# Altium project solar_power.PrjPCB
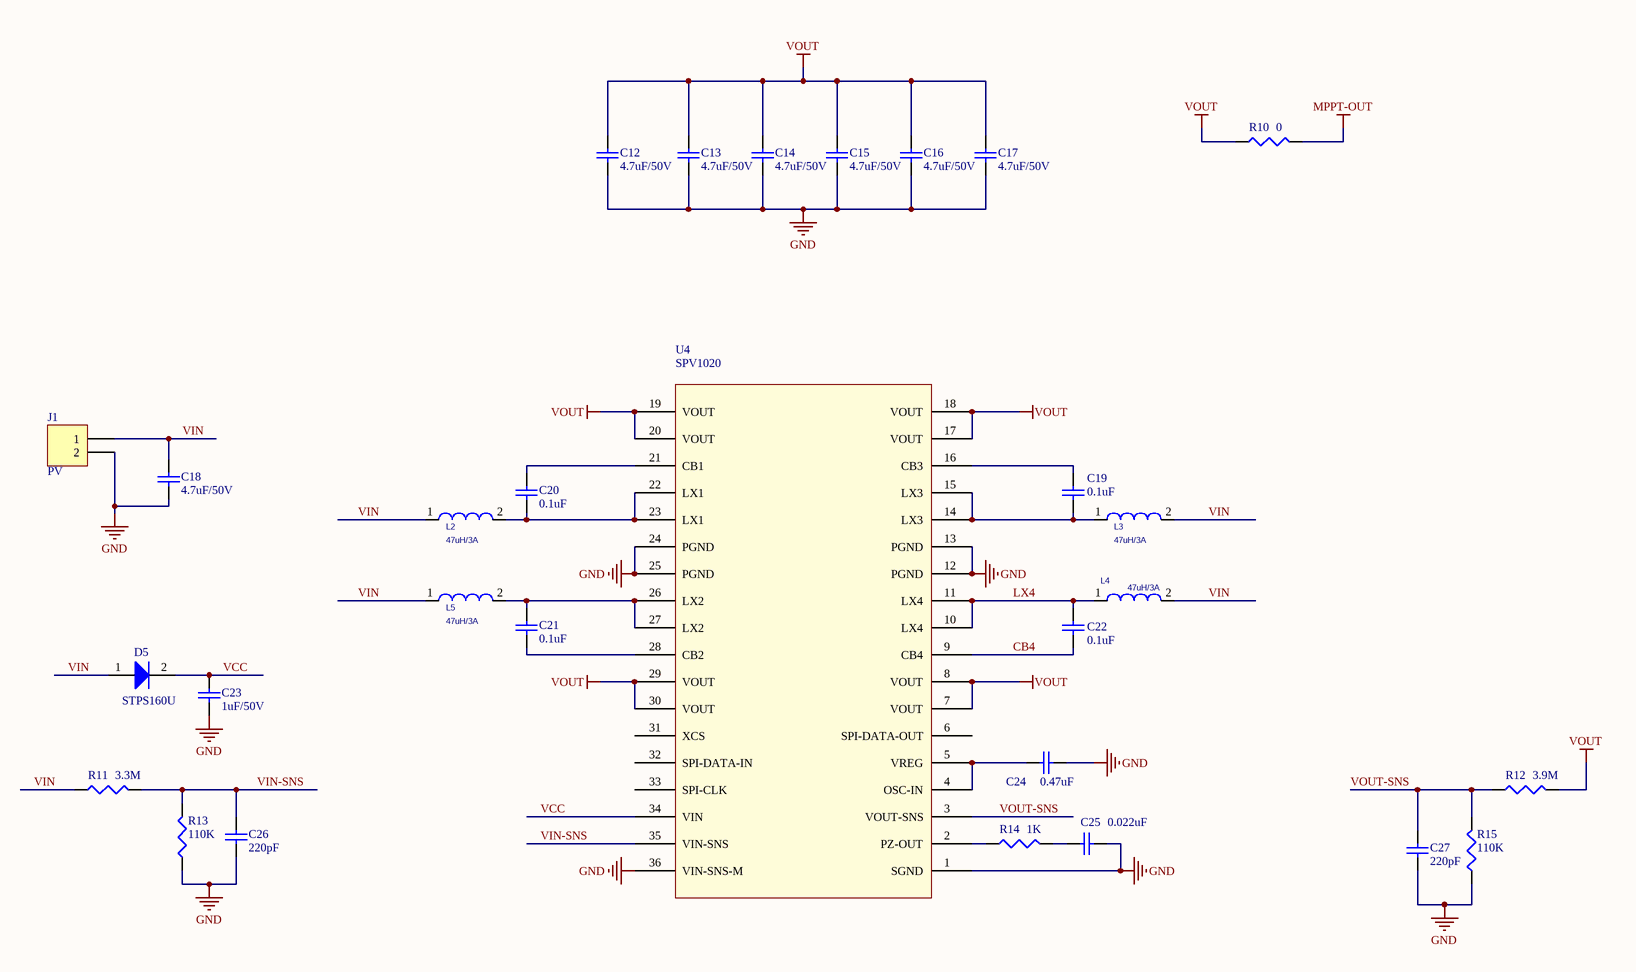
[diagram p0: mppt.SchDoc]
3 sheets, 84 parts. Net scope: global (net labels, ports and power ports of the same name join across sheets).
Board file: solar_power.PcbDoc
Sheets:
  mppt.SchDoc
  cc_cv_charger.SchDoc
  overdischarge_protection.SchDoc

## Sheet mppt.SchDoc
size B

### Parts
C12  4.7uF/50V  [1812]
C13  4.7uF/50V  [1812]
C14  4.7uF/50V  [1812]
C15  4.7uF/50V  [1812]
C16  4.7uF/50V  [1812]
C17  4.7uF/50V  [1812]
C18  4.7uF/50V  [1812]
C19  0.1uF  [0603]
C20  0.1uF  [0603]
C21  0.1uF  [0603]
C22  0.1uF  [0603]
C23  1uF/50V  [1210]
C24  0.47uF  [0603]
C25  0.022uF  [0603]
C26  220pF  [0603]
C27  220pF  [0603]
D5  STPS160U  [B320A]
J1  PV  [T-2PIN]
L2  47uH/3A  [IND-47UH-3A]
L3  47uH/3A  [IND-47UH-3A]
L4  47uH/3A  [IND-47UH-3A]
L5  47uH/3A  [IND-47UH-3A]
R10  0  [BREAK]
R11  3.3M  [0603]
R12  3.9M  [0603]
R13  110K  [0603]
R14  1K  [0603]
R15  110K  [0603]
U4  SPV1020  [POWERSSOP36]

### Nets
GND: C12.1 C13.1 C14.1 C15.1 C16.1 C17.1 C18.1 C23.1 C24.2 C25.2 C26.1 C27.1 J1.2 R13.1 R15.1 U4.1(SGND) U4.12(PGND) U4.13(PGND) U4.24(PGND) U4.25(PGND) U4.36(VIN-SNS-M)
MPPT-OUT: R10.2
VOUT: C12.2 C13.2 C14.2 C15.2 C16.2 C17.2 R10.1 R12.2 U4.7(VOUT) U4.8(VOUT) U4.17(VOUT) U4.18(VOUT) U4.19(VOUT) U4.20(VOUT) U4.29(VOUT) U4.30(VOUT)
CB4: C22.1 U4.9(CB4)
LX4: C22.2 L4.1 U4.10(LX4) U4.11(LX4)
VCC: C23.2 D5.2(K) U4.34(VIN)
VIN: C18.2 D5.1(A) J1.1 L2.1 L3.2 L4.2 L5.1 R11.1
VIN-SNS: C26.2 R11.2 R13.2 U4.35(VIN-SNS)
VOUT-SNS: C27.2 R12.1 R15.2 U4.3(VOUT-SNS)
NetC19_1: C19.1 L3.1 U4.14(LX3) U4.15(LX3)
NetC19_2: C19.2 U4.16(CB3)
NetC20_1: C20.1 L2.2 U4.22(LX1) U4.23(LX1)
NetC20_2: C20.2 U4.21(CB1)
NetC21_1: C21.1 U4.28(CB2)
NetC21_2: C21.2 L5.2 U4.26(LX2) U4.27(LX2)
NetC24_1: C24.1 U4.4(OSC-IN) U4.5(VREG)
NetC25_1: C25.1 R14.2
NetR14_1: R14.1 U4.2(PZ-OUT)

Not connected (* = marked no-connect by the designer): U4 6(SPI-DATA-OUT) 31(XCS) 32(SPI-DATA-IN) 33(SPI-CLK)

### Library data of the parts
C12-C27 = Cap: Capacitor; Value: 100pF; Published: 8-Jun-2000; LatestRevisionDate: 17-Jul-2002; LatestRevisionNote: Re-released for DXP Platform.; PackageReference: RAD-0.3; Publisher: Altium Limited; PackageDescription: Radial Cap, Thru-Hole; 2 Leads; 0.3 in Pin Spacing
D5 = Diode: Default Diode; Published: 8-Jun-2000; LatestRevisionDate: 17-Jul-2002; LatestRevisionNote: Re-released for DXP Platform.; PackageVersion: Sep-1996; PackageReference: SMC; Publisher: Altium Limited; PackageDescription: DO-214-AB/SMC; 2 C-Bend Leads; Body 7.9 x 5.9 mm, inc. leads (LxW); Code_JEDEC: DO-214-AB
J1 = Header 2: Header, 2-Pin; LatestRevisionDate: 17-Jul-2002; LatestRevisionNote: Re-released for DXP Platform.; Publisher: Altium Limited
L2-L5 = 4.7UH_CDH2D09BNP-4R7MC_0.7A_20%: Part Number: SH00000AJ00; ROOM: +1.3V_CORE
R10-R13 R15 = Res3: Resistor; Value: 1K; Published: 8-Jun-2000; LatestRevisionDate: 29-May-2009; LatestRevisionNote: IPC-7351 Footprint Added.; PackageReference: J1-0603; Publisher: Altium Limited; PackageDescription: Chip Resistor
R14 = Res3: Resistor; Published: 8-Jun-2000; LatestRevisionDate: 29-May-2009; LatestRevisionNote: IPC-7351 Footprint Added.; PackageReference: J1-0603; Publisher: Altium Limited; PackageDescription: Chip Resistor; Value: 1K

## Sheet cc_cv_charger.SchDoc
size B
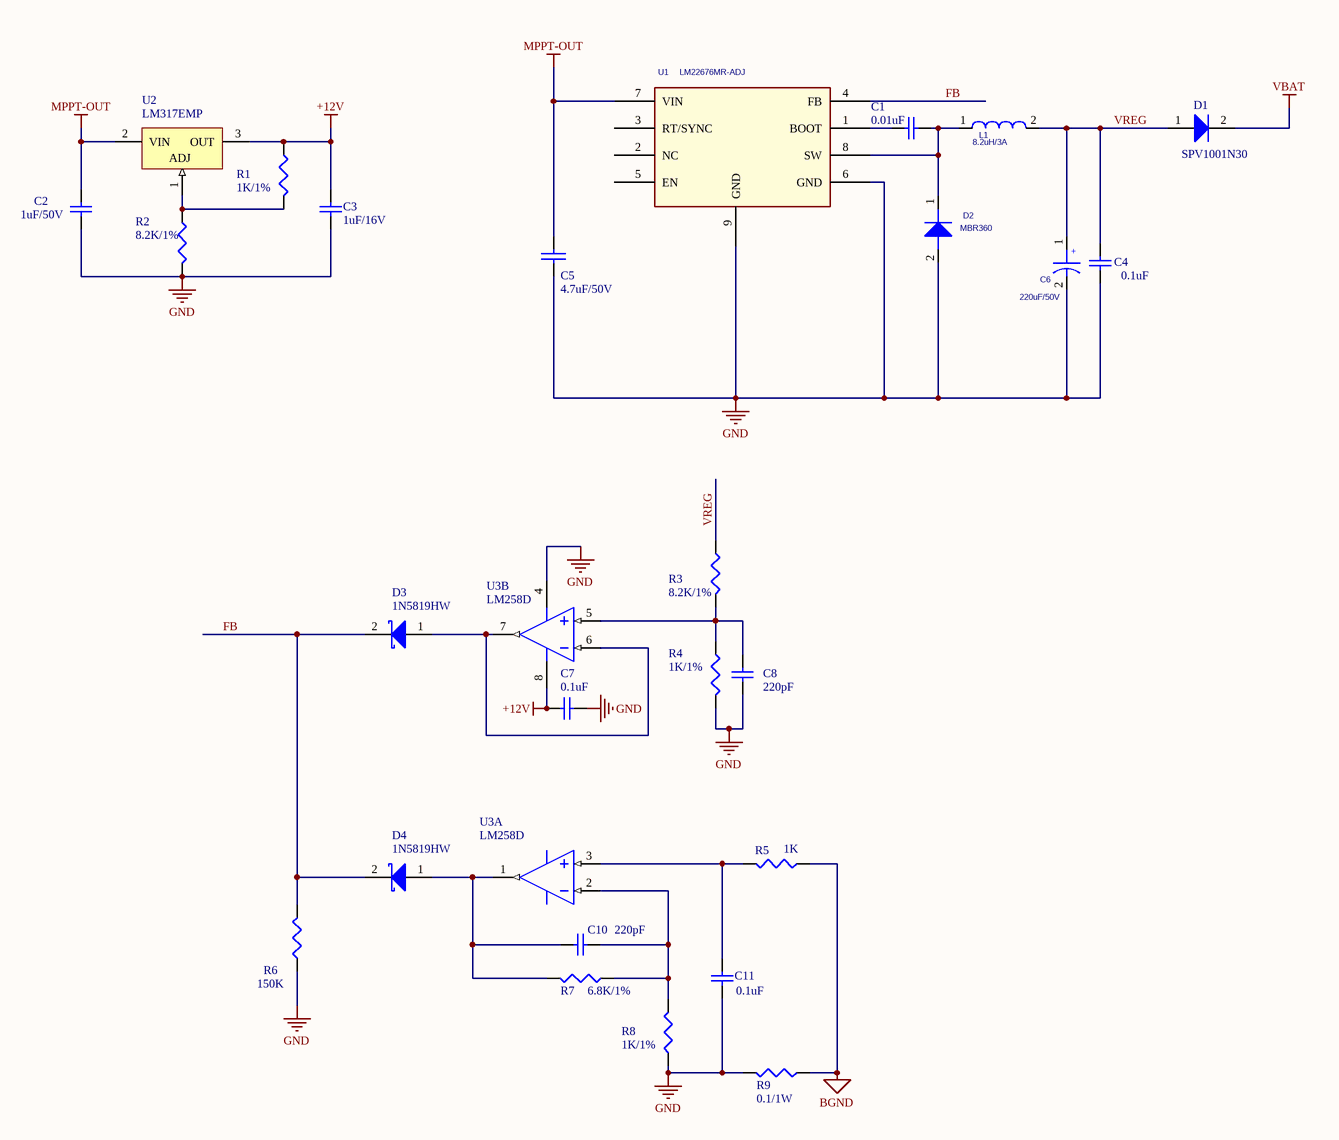
[diagram p1: cc_cv_charger.SchDoc]

### Parts
C1  0.01uF  [0603]
C2  1uF/50V  [1210]
C3  1uF/16V  [0805]
C4  0.1uF  [0603]
C5  4.7uF/50V  [1812]
C6  220uF/50V  [DL-10*10.5]
C7  0.1uF  [0603]
C8  220pF  [0603]
C10  220pF  [0603]
C11  0.1uF  [0603]
D1  SPV1001N30  [SPV1001]
D2  MBR360  [DO214AB]
D3  1N5819HW  [1N5819]
D4  1N5819HW  [1N5819]
L1  8.2uH/3A  [IND_8.2UH_3A]
R1  1K/1%  [0603]
R2  8.2K/1%  [0603]
R3  8.2K/1%  [0603]
R4  1K/1%  [0603]
R5  1K  [0603]
R6  150K  [0603]
R7  6.8K/1%  [0603]
R8  1K/1%  [0603]
R9  0.1/1W  [2512]
U1  LM22676MR-ADJ  [PSO8]
U2  LM317EMP  [LM317]
U3  LM258D  [SO8]  (parts A,B of 2)

### Nets
+12V: C3.2 C7.2 R1.1 U2.3(OUT) U3.8(V+)
BGND: R5.1 R9.1
GND: C2.1 C3.1 C4.1 C5.2 C6.2 C7.1 C8.2 C11.2 D2.2 R2.2 R4.2 R6.1 R8.1 R9.2 U1.6(GND) U1.9(GND) U3.4(GND)
MPPT-OUT: C2.2 C5.1 U1.7(VIN) U2.2(VIN)
VBAT: D1.2(K)
FB: D3.2(K) D4.2(K) R6.2 U1.4(FB)
VREG: C4.2 C6.1 D1.1(A) L1.2 R3.1
NetC1_1: C1.1 D2.1 L1.1 U1.8(SW)
NetC1_2: C1.2 U1.1(BOOT)
NetC8_1: C8.1 R3.2 R4.1 U3.5(INB+)
NetC10_1: C10.1 R7.1 R8.2 U3.2(INA-)
NetC10_2: C10.2 D4.1(A) R7.2 U3.1(OUTA)
NetC11_1: C11.1 R5.2 U3.3(INA+)
NetD3_1: D3.1(A) U3.6(INB-) U3.7(OUTB)
NetR1_2: R1.2 R2.1 U2.1(ADJ)

Not connected (* = marked no-connect by the designer): U1 2(NC) 3(RT/SYNC) 5(EN)

### Notes on the sheet
- (in symbol CAP WP) +

### Library data of the parts
C1-C3 = Cap: Capacitor; Value: 0.1uF; Published: 8-Jun-2000; LatestRevisionDate: 17-Jul-2002; LatestRevisionNote: Re-released for DXP Platform.; PackageReference: RAD-0.3; Publisher: Altium Limited; PackageDescription: Radial Cap, Thru-Hole; 2 Leads; 0.3 in Pin Spacing
C4 C7 C11 = Cap: Capacitor; Published: 8-Jun-2000; LatestRevisionDate: 17-Jul-2002; LatestRevisionNote: Re-released for DXP Platform.; PackageReference: RAD-0.3; Publisher: Altium Limited; PackageDescription: Radial Cap, Thru-Hole; 2 Leads; 0.3 in Pin Spacing; Value: 0.1uF
C5 = CAP: Capacitor
C6 = CAP WP
C8 C10 = Cap: Capacitor; Value: 1000pF; Published: 8-Jun-2000; LatestRevisionDate: 17-Jul-2002; LatestRevisionNote: Re-released for DXP Platform.; PackageReference: RAD-0.3; Publisher: Altium Limited; PackageDescription: Radial Cap, Thru-Hole; 2 Leads; 0.3 in Pin Spacing
D1 = Diode: Default Diode; Published: 8-Jun-2000; LatestRevisionDate: 17-Jul-2002; LatestRevisionNote: Re-released for DXP Platform.; PackageVersion: Sep-1996; PackageReference: SMC; Publisher: Altium Limited; PackageDescription: DO-214-AB/SMC; 2 C-Bend Leads; Body 7.9 x 5.9 mm, inc. leads (LxW); Code_JEDEC: DO-214-AB
D2 = 1N4148WS-7-F_SOD323-2
D3 D4 = Diode 11DQ03: Schottky Rectifier
L1 = 4.7UH_CDH2D09BNP-4R7MC_0.7A_20%: as L2 on sheet mppt
R1-R4 R8 = Res3: Resistor; Value: 1K; Published: 8-Jun-2000; LatestRevisionDate: 29-May-2009; LatestRevisionNote: IPC-7351 Footprint Added.; PackageReference: J1-0603; Publisher: Altium Limited; PackageDescription: Chip Resistor
R5 R6 R9 = Res3: Resistor; Published: 8-Jun-2000; LatestRevisionDate: 29-May-2009; LatestRevisionNote: IPC-7351 Footprint Added.; PackageReference: J1-0603; Publisher: Altium Limited; PackageDescription: Chip Resistor
  R5: Value: 1K
  R6: Value: 150K
  R9: Value: 0.1/1W
R7 = Res3: Resistor; Value: 5.1K; Published: 8-Jun-2000; LatestRevisionDate: 29-May-2009; LatestRevisionNote: IPC-7351 Footprint Added.; PackageReference: J1-0603; Publisher: Altium Limited; PackageDescription: Chip Resistor
U1 = LM22670_0
U2 = LM317K STEEL: 3-Terminal Adjustable Regulator, 3-pin TO-3; Manufacturer: National Semiconductor; PackageTopMarking: NS*ZXYTTE#*LM317K*STEELP+; PowerWise: N; CompType: MiscPower; High-Reliability: Y; Published: 4-Dec-2008; DatasheetVersion: Mar-2010; PackageVersion: revG, Oct-1991; PackageReference: K02A; Publisher: Altium Limited; PackageDescription: Metal Can (KA) TO-3, 2 Lead; PartNumber: LM317K STEEL; RoHS: N; PinCount: 2; ComponentLink1Description: LM317 Datasheet; ComponentLink1URL: http://www.national.com/ds/LM/LM317.pdf; ComponentLink2Description: LM317 Web Page; ComponentLink2URL: http://www.national.com/pf/LM/LM317.html; ComponentLink3Description: K02A Package Page; ComponentLink3URL: http://www.national.com/packaging/folders/k02a.html
U3 = LM258H: Low Power Dual Operational Amplifier, 8-pin TO-99; Manufacturer: National Semiconductor; PackageTopMarking: NSZXYTTE# LM258H; PowerWise: N; CompType: Amplifiers; High-Reliability: Y; Published: 4-Dec-2008; DatasheetVersion: Oct-2005; PackageVersion: revF, Jun-1995; PackageReference: H08C; Publisher: Altium Limited; PackageDescription: Metal Can, TO-99, 8 Lead, .200 Dia., P.C.; PartNumber: LM258H; RoHS: N; PinCount: 8; Code_JEDEC: TO-99; ComponentLink1Description: LM258 Datasheet; ComponentLink1URL: http://www.national.com/ds/LM/LM258.pdf; ComponentLink2Description: LM258 Web Page; ComponentLink2URL: http://www.national.com/pf/LM/LM258.html; ComponentLink3Description: H08C Package Page; ComponentLink3URL: http://www.national.com/packaging/folders/h08c.html

## Sheet overdischarge_protection.SchDoc
size A4
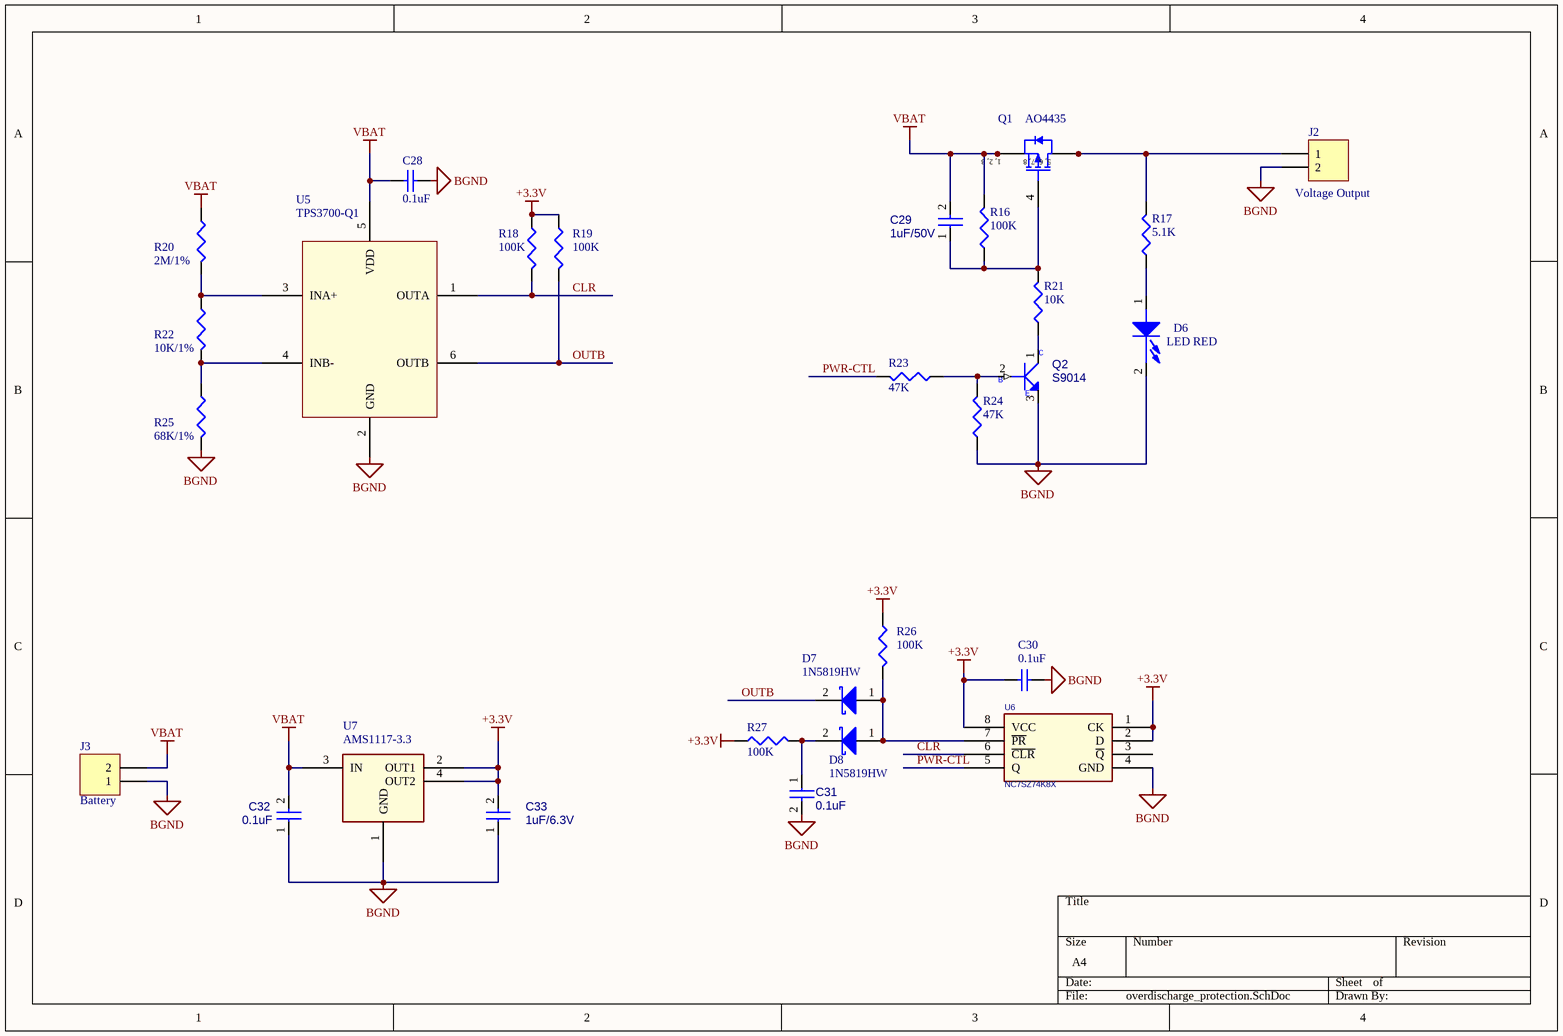
[diagram p2: overdischarge_protection.SchDoc]

### Parts
C28  0.1uF  [0603]
C29  1uF/50V  [1210]
C30  0.1uF  [0603]
C31  0.1uF  [0603]
C32  0.1uF  [0603]
C33  1uF/6.3V  [0603]
D6  LED RED  [LED0603]
D7  1N5819HW  [1N5819]
D8  1N5819HW  [1N5819]
J2  Voltage Output  [T-2PIN]
J3  Battery  [T-2PIN]
Q1  AO4435  [SO8]
Q2  S9014  [NPN]
R16  100K  [0603]
R17  5.1K  [0603]
R18  100K  [0603]
R19  100K  [0603]
R20  2M/1%  [0603]
R21  10K  [0603]
R22  10K/1%  [0603]
R23  47K  [0603]
R24  47K  [0603]
R25  68K/1%  [0603]
R26  100K  [0603]
R27  100K  [0603]
U5  TPS3700-Q1  [SOT23-6]
U6  NC7SZ74K8X  [US8]
U7  AMS1117-3.3  [AMS1117]

### Nets
+3.3V: C30.2 C33.2 R18.1 R19.1 R26.1 R27.1 U6.1(CK) U6.2(D) U6.8(VCC) U7.2(OUT1) U7.4(OUT2)
BGND: C28.1 C30.1 C31.2 C32.1 C33.1 D6.2(CATHODE) J2.2 J3.1 Q2.3(EMITTER) R24.1 R25.2 U5.2(GND) U6.4(GND) U7.1(GND)
VBAT: C28.2 C29.2 C32.2 J3.2 Q1.1(S) Q1.2(S) Q1.3(S) R16.2 R20.1 U5.5(VDD) U7.3(IN)
CLR: R18.2 U5.1(OUTA) U6.6(~{CLR})
OUTB: D7.2(K) R19.2 U5.6(OUTB)
PWR-CTL: R23.2 U6.5(Q)
NetC29_1: C29.1 Q1.4(G) R16.1 R21.2
NetC31_1: C31.1 D8.2(K) R27.2
NetD6_1: D6.1(ANODE) R17.1
NetD7_1: D7.1(A) D8.1(A) R26.2 U6.7(~{PR})
NetJ2_1: J2.1 Q1.5(D) Q1.6(D) Q1.7(D) Q1.8(D) R17.2
NetQ2_1: Q2.1(COLLECTOR) R21.1
NetQ2_2: Q2.2(BASE) R23.1 R24.2
NetR20_2: R20.2 R22.1 U5.3(INA+)
NetR22_2: R22.2 R25.1 U5.4(INB-)

Not connected (* = marked no-connect by the designer): U6 3(~{Q})

### Notes on the sheet
- (in symbol MMBT3904_NL_SOT23-3) C; B; E
- (in symbol SI4431DY) 1, 2, 3; 5, 6, 7, 8

### Library data of the parts
C28 C30 = Cap: Capacitor; Published: 8-Jun-2000; LatestRevisionDate: 17-Jul-2002; LatestRevisionNote: Re-released for DXP Platform.; PackageReference: RAD-0.3; Publisher: Altium Limited; PackageDescription: Radial Cap, Thru-Hole; 2 Leads; 0.3 in Pin Spacing; Value: 0.1uF
C29 C31-C33 = CAP NP_Dup2
D6 = LN01401_1
D7 D8 = Diode 11DQ03: Schottky Rectifier
J2 J3 = Header 2: Header, 2-Pin; LatestRevisionDate: 17-Jul-2002; LatestRevisionNote: Re-released for DXP Platform.; Publisher: Altium Limited
Q1 = SI4431DY: P-Channel 30V (D-S)  MOSFET; Published: 8-Jun-2000; LatestRevisionDate: 13-Apr-2006; LatestRevisionNote: IPC-7351 Footprint Added.; DatasheetVersion: 6-Oct-1997; PackageVersion: Aug-1998; PackageReference: SO-8; Publisher: Altium Limited; PackageDescription: 8-Pin Small Outline Integrated Circuit 1.27 mm Pitch; ComponentLink1Description: Manufacturer Link; ComponentLink1URL: http://www.vishay.com/; ComponentLink2Description: Datasheet; ComponentLink2URL: http://www.vishay.com/docs/70151/70151.pdf
Q2 = MMBT3904_NL_SOT23-3: Part Description: S TR MMBT3904_NL NPN SOT23; Part Number: SB039040000
R16 R17 R21 R23 R24 = CR16-1003FM
R18-R20 R22 R25-R27 = Res3: Resistor; Value: 1K; Published: 8-Jun-2000; LatestRevisionDate: 29-May-2009; LatestRevisionNote: IPC-7351 Footprint Added.; PackageReference: J1-0603; Publisher: Altium Limited; PackageDescription: Chip Resistor
U6 = NC7SZ74-US8_0: IC;NC7SZ74,D-TYPE FLIP-FLOP,US8; VENDER: FAIRCHILD; P/N: XXXXXXXXXXXX; PKG: US8; device: US8
U7 = LT1963EST-1_4.8

## Nets that join several sheets
BGND: cc_cv_charger (R5.1 R9.1), overdischarge_protection (14 pins)
GND: mppt (21 pins), cc_cv_charger (17 pins)
MPPT-OUT: mppt (R10.2), cc_cv_charger (C2.2 C5.1 U1.7 U2.2)
VBAT: cc_cv_charger (D1.2), overdischarge_protection (11 pins)